# Altium schematic sheet Sheet2.SchDoc
size A4; SheetNumber: 13; SheetTotal: 13
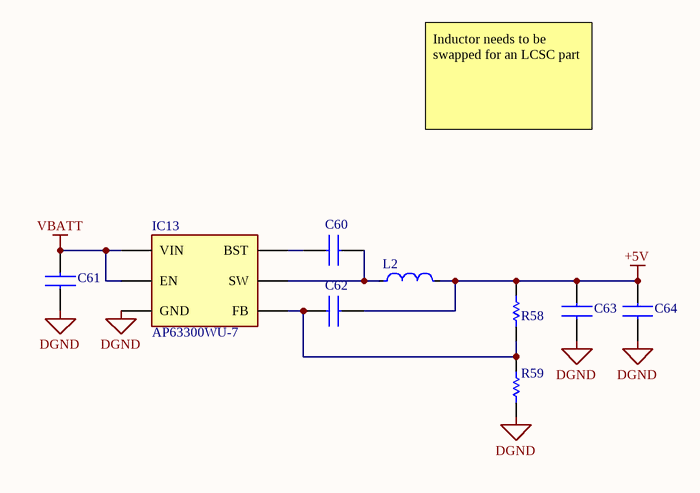
[diagram p0: Sheet2.SchDoc]

## Parts
C60  0603,X7R,100nF,50V,10%  [CAPC1608X90N]  (value not drawn)
C61  0805,X7R,10uF,25V,10%  [CAPC2012X145N]  (value not drawn)
C62  0603,NP0,47pF,50V,5%  [CAPC1608X90N]  (value not drawn)
C63  0805,X5R,22uF,25V,20%  [CAPC2012X145N]  (value not drawn)
C64  0805,X5R,22uF,25V,20%  [CAPC2012X145N]  (value not drawn)
IC13  AP63300WU-7  [SOT95P280X90-6N]
L2  FXL0630-6R8-M  [FXL0630-6R8-M]  (value not drawn)
R58  FRC0603F1583TS  [FRC0603F1583TS]  (value not drawn)
R59  RC0603FR-0730K1L  [RC0603FR-0730K1L]  (value not drawn)

## Nets
+5V: C62.1 C63.2 C64.2 L2.2 R58.2
DGND: C61.2 C63.1 C64.1 IC13.4(GND) R59.1
VBATT: C61.1 IC13.2(EN) IC13.3(VIN)
NetC60_1: C60.1 IC13.6(BST)
NetC60_2: C60.2 IC13.5(SW) L2.1
NetC62_2: C62.2 IC13.1(FB) R58.1 R59.2

## Notes on the sheet
- Inductor needs to be swapped for an LCSC part

## Library data of the parts
C60 = CC0603KRX7R9BB104: 50V 100nF X7R ±10% 0603 Multilayer Ceramic Capacitors MLCC - SMD/SMT ROHS; LCSC Part #: C14663; Manu Part #: CC0603KRX7R9BB104
C61 = CL21B106KAYQNNE: 10uF ±10% 25V Ceramic Capacitor X7R 0805; LCSC Part #: C3039694; Manu Part #: CL21B106KAYQNNE
C62 = CC0603JRNPO9BN470: 47 pF ±5% 50V Ceramic Capacitor C0G, NP0 0603 (1608 Metric); Manu Part #: CC0603JRNPO9BN470; LCSC Part #: C105622
C63 C64 = CL21A226MAYNNNE: 22uF ±20% 25V Ceramic Capacitor X5R 0805; LCSC Part #: C602037; Manu Part #: CL21A226MAYNNNE
IC13 = AP63300WU-7: Integrated Circuit; Manufacturer_Name: Diodes Incorporated; Datasheet Link: https://www.diodes.com//assets/Datasheets/AP63300-AP63301.pdf; Height: 0.9mm; Manufacturer_Part_Number: AP63300WU-7; Mouser Part Number: 621-AP63300WU-7; Mouser Price/Stock: https://www.mouser.co.uk/ProductDetail/Diodes-Incorporated/AP63300WU-7?qs=bZr6mbWTK5nNNXnHDcrFZg%3D%3D; Arrow Part Number: AP63300WU-7; Arrow Price/Stock: https://www.arrow.com/en/products/ap63300wu-7/diodes-incorporated?utm_currency=USD&region=nac
L2 = FXL0630-6R8-M: 48mΩ 5A 6.8uH 6A Molded Inductor ±20% SMD,7x6.6mm Power Inductors ROHS; Manufacturer: cjiang (Changjiang Microelectronics Tech); ki_keywords: C167221 FXL0630-6R8-M IND-SMD_L7.0-W6.6 cjiang (Changjiang Microelectronics Tech); Footprint: JLCImport:FXL0630-6R8-M; Datasheet: https://www.lcsc.com/datasheet/lcsc_datasheet_2404260921_cjiang--Changjiang-Microelectronics-Tech-FXL0630-6R8-M_C167221.pdf; Description_: 48mΩ 5A 6.8uH 6A Molded Inductor ±20% SMD,7x6.6mm Power Inductors ROHS; LCSC: C167221; Manufacturer Part: FXL0630-6R8-M
R58 = FRC0603F1583TS: -55℃~+155℃ 100mW 158kΩ 75V Thick Film Resistor ±1% ±100ppm/℃ 0603 Chip Resistor - Surface Mount ROHS; Manufacturer: FOJAN; ki_keywords: C2974029 FOJAN FRC0603F1583TS R0603; Footprint: JLCImport:FRC0603F1583TS; Datasheet: https://wmsc.lcsc.com/wmsc/upload/file/pdf/v2/lcsc/2202151130_FOJAN-FRC0603F1583TS_C2974029.pdf; Description_: -55℃~+155℃ 100mW 158kΩ 75V Thick Film Resistor ±1% ±100ppm/℃ 0603 Chip Resistor - Surface Mount ROHS; LCSC: C2974029; Manufacturer Part: FRC0603F1583TS
R59 = RC0603FR-0730K1L: -55℃~+155℃ 100mW 30.1kΩ 75V Thick Film Resistor ±1% ±100ppm/℃ 0603 Chip Resistor - Surface Mount ROHS; Manufacturer: YAGEO; ki_keywords: C137745 R0603 RC0603FR-0730K1L YAGEO; Footprint: JLCImport:RC0603FR-0730K1L; Datasheet: https://www.lcsc.com/datasheet/lcsc_datasheet_2304140030_YAGEO-RC0603FR-0730K1L_C137745.pdf; Description_: -55℃~+155℃ 100mW 30.1kΩ 75V Thick Film Resistor ±1% ±100ppm/℃ 0603 Chip Resistor - Surface Mount ROHS; LCSC: C137745; Manufacturer Part: RC0603FR-0730K1L